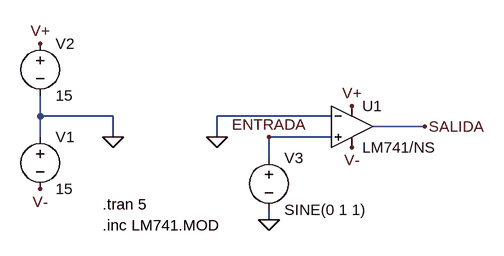
[diagram p0: schematic lm741-comparador.asc]
lm741-comparador.asc, the LTspice schematic file:
Version 4
SHEET 1 908 680
WIRE -64 160 -64 128
WIRE 48 160 -64 160
WIRE 384 160 208 160
WIRE 528 176 448 176
WIRE -64 192 -64 160
WIRE 48 192 48 160
WIRE 208 192 208 160
WIRE 384 192 288 192
WIRE 288 224 288 192
WIRE 288 320 288 304
FLAG 288 320 0
FLAG 48 192 0
FLAG 528 176 SALIDA
FLAG -64 48 V+
FLAG 416 144 V+
FLAG -64 272 V-
FLAG 416 208 V-
FLAG 288 192 ENTRADA
FLAG 208 192 0
SYMBOL Opamps\\opamp2 416 112 R0
SYMATTR InstName U1
SYMATTR Value LM741/NS
SYMBOL voltage -64 176 R0
WINDOW 123 0 0 Left 0
WINDOW 39 0 0 Left 0
SYMATTR InstName V1
SYMATTR Value 15
SYMBOL voltage -64 32 R0
WINDOW 123 0 0 Left 0
WINDOW 39 0 0 Left 0
SYMATTR InstName V2
SYMATTR Value 15
SYMBOL voltage 288 208 R0
WINDOW 123 0 0 Left 0
WINDOW 39 0 0 Left 0
SYMATTR InstName V3
SYMATTR Value SINE(0 1 1)
TEXT 32 296 Left 2 !.tran 5
TEXT 32 328 Left 2 !.inc LM741.MOD

The netlist it stands for:
* lm741-comparador.asc
XU1 ENTRADA 0 V+ V- SALIDA LM741/NS  ; pins In+ In- V+ V- OUT
V1 0 V- 15
V2 V+ 0 15
V3 ENTRADA 0 SINE(0 1 1)
.tran 5
.inc LM741.MOD
.backanno
.end